# EAGLE design fan control (EAGLE 9.3.2)
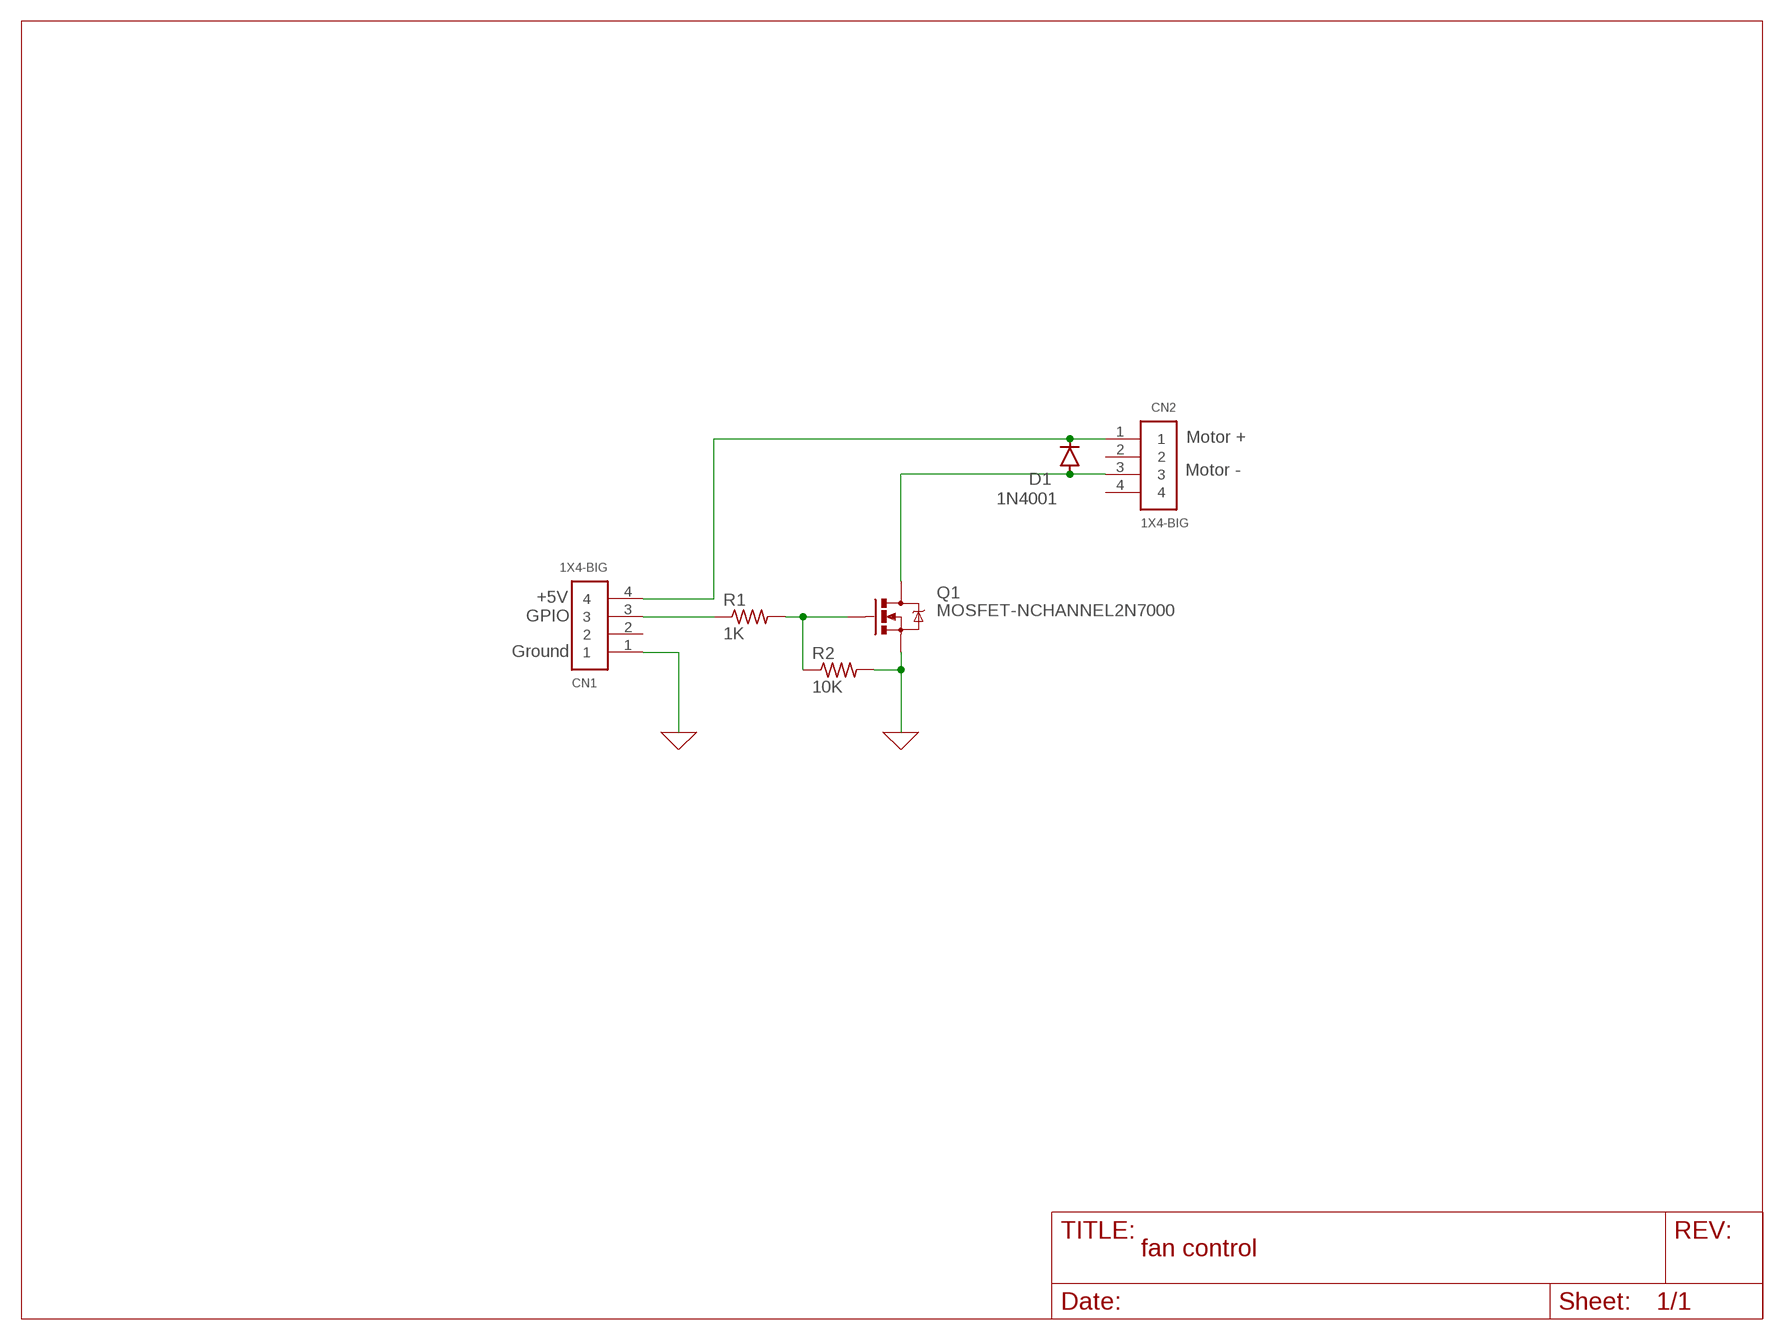
[diagram p0: schematic, sheet 1]

## Parts
CN1  1X4-BIG  [1X04-BIG]
CN2  1X4-BIG  [1X04-BIG]
D1  1N4001  1N4004  [DO-41]
Q1  MOSFET-NCHANNEL2N7000  [TO-92]
R1  1K  R-US_0207/10  [0207/10]
R2  10K  R-US_0207/10  [0207/10]

## Nets
0: CN1.1 Q1.1(S) R2.2 ; supply symbol labelled GND
N$1: CN1.4 CN2.1 D1.C
N$2: Q1.2(G) R1.2 R2.1
N$3: CN1.3 R1.1
N$4: CN2.3 D1.A Q1.3(D)
Unconnected: CN1.2 CN2.2 CN2.4

## Notes on the sheet
- Motor +
- Motor -
- +5V
- GPIO
- Ground

## Library data of the parts
CN1 CN2 = adafruit:1X4: 4-pin connector
D1 = Diodes:1N4004: DIODE GEN PURP 400V 1A DO41 Manufacturer's datasheet <https://www.mccsemi.com/pdf/Products/1N4001-1N4007(DO-41).pdf>; CREATED_BY: PCBLayout.com; DIGIKEY_PART_NUMBER: 1N4004MSCT-ND; MANUFACTURER: Micro Commercial Co; MPN: 1N4004; PACKAGE: DO-41
Q1 = digikey:MOSFET-NCHANNEL: Common NMOSFET Parts MFG P/N Store ID Prod ID FDD8780 TRANS-09984 SI7820DN TRANS-11055 FDS6630A IC-08089 2N7002PW TRANS-11151 FQP30N06L COM-10213 TRANS-10060 BSS123LT1G TRANS-08345 BSS138 TRANS-00830 BS170 2N7000
R1 R2 = adafruit:R-US_: RESISTOR, American symbol

## Board
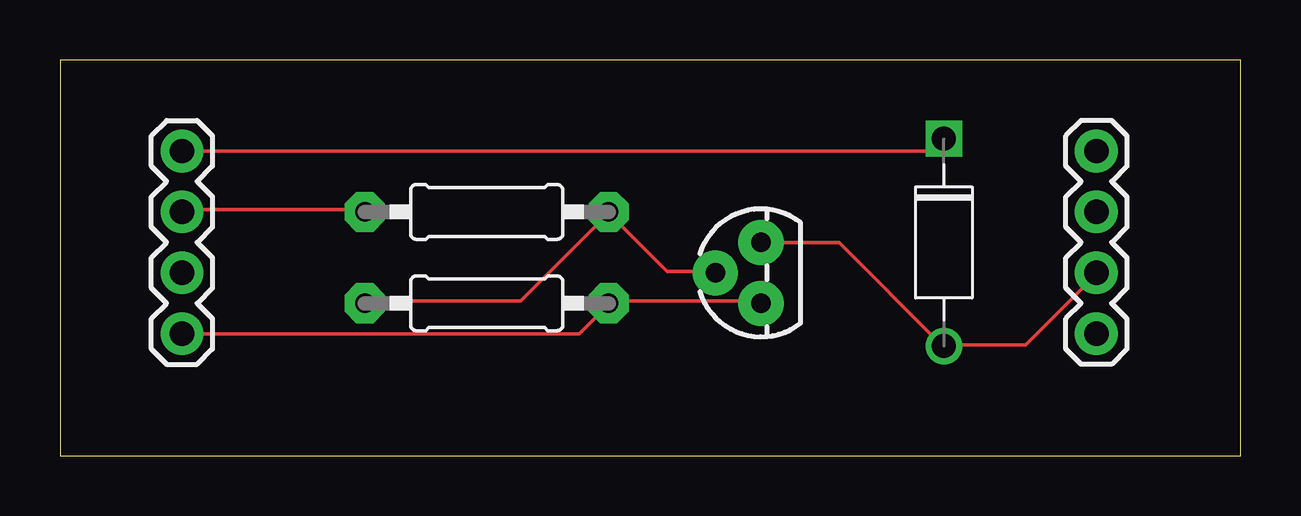
[diagram p1: board, top side]
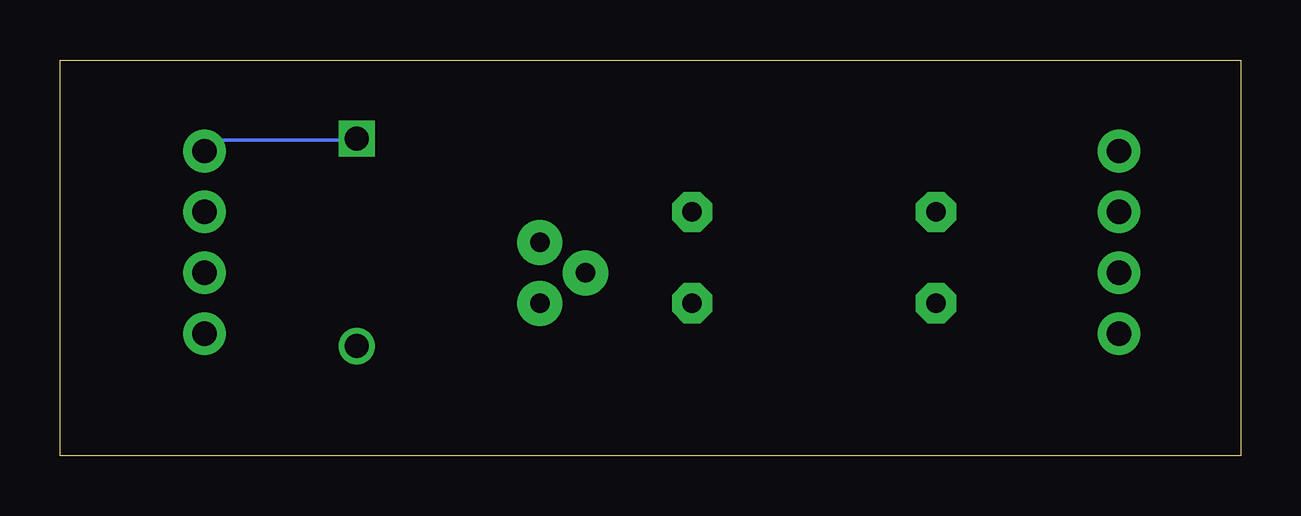
[diagram p2: board, bottom side, seen from below]

Size 49.2 x 16.5 mm. Coordinates in mm from the lower left corner, seen from the top.
Outline: 0,0 49.2,0 49.2,16.5 0,16.5 0,0
Copper layers (1*16): Top 0.035mm / dielectric 1.5mm / Bottom 0.035mm
Design rules "default": minimum track width 6mil, minimum drill 0.35mm, track to track 6mil, track to pad 6mil, pad to pad 6mil, via to via 6mil, smd to smd 6mil, copper to edge 40mil, drill to drill 6mil, minimum pad ring 10mil, minimum via ring 8mil, stop-mask expansion 4mil, vias tented up to drill 0mil, thermal gap 10mil

### Footprints (pad centres in the part's own frame; a part is rotated, then mirrored left to right if it is on the bottom)
1X04-BIG = drill 1.016 pad 1.778: 1 0,0; 2 2.54,0; 3 5.08,0; 4 7.62,0
DO-41 = drill 1: A 4.325,0 | drill 1 square: C -4.325,0
TO-92 = drill 0.813 pad 1.88: 1 -1.27,0; 2 0,1.905; 3 1.27,0
0207/10 = drill 0.813 pad 1.676 octagon: 1 -5.08,0; 2 5.08,0

### Placement (x,y rotation side)
CN1  5.08,5.08 90 top
CN2  43.18,12.7 270 top
D1  36.83,8.89 270 top
Q1  29.21,7.62 90 top
R1  17.78,10.16 0 top
R2  17.78,6.35 0 top

### Tracks (layer width: path | path; a pad name or v marks a point on that pad's centre or on a via)
0
  Top 0.152: Q1.1 29.11,6.45 22.86,6.45 R2.2 22.86,6.3 21.64,5.08 CN1.1
N$1
  Top 0.152: CN1.4 36.27,12.7 36.73,13.16 D1.C
  Bottom 0.152: D1.C 36.88,13.16 42.67,13.16 43.13,12.7 CN2.1
N$2
  Top 0.152: 22.86,10.11 19.2,6.45 12.8,6.45 R2.1 | 22.86,10.11 25.3,7.67 27.28,7.67 Q1.2 | 22.86,10.11 R1.2
N$3
  Top 0.152: R1.1 12.65,10.26 5.18,10.26 CN1.3
N$4
  Top 0.152: CN2.3 43.13,7.52 40.23,4.62 36.88,4.62 D1.A 36.73,4.62 32.46,8.89 Q1.3